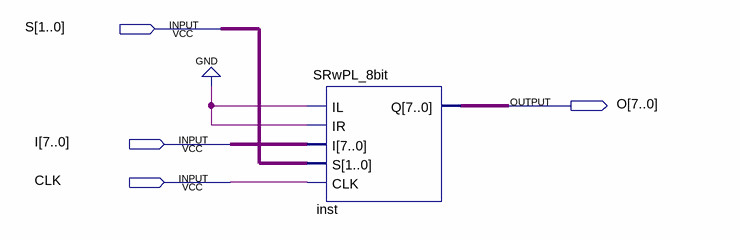
[diagram p0: schematic sheet]
// Quartus schematic Shifter.bdf as structural Verilog: 1 symbols, 4 pins
module Shifter (
  input  [1:0] S,
  input  [7:0] I,
  input  CLK,
  output [7:0] O
);

  SRwPL_8bit inst (.IL(1'b0), .IR(1'b0), .I(I), .S(S), .CLK(CLK), .Q(O));
endmodule
